# Altium schematic sheet Flash.SchDoc
size A4; SheetNumber: 8; SheetTotal: 10
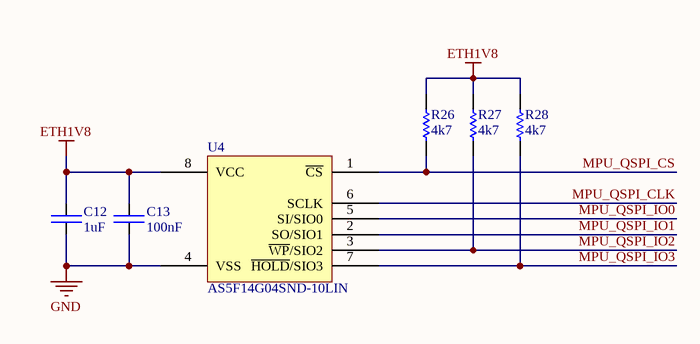
[diagram p0: Flash.SchDoc]

## Parts
C12  1uF  [CAP-0805]
C13  100nF  [CAP-0603]
R26  4k7  [RES-0603]
R27  4k7  [RES-0603]
R28  4k7  [RES-0603]
U4  AS5F14G04SND-10LIN  [AS5F34G04SNDA-08LIN]

## Nets
ETH1V8: C12.2 C13.2 R26.2 R27.2 R28.2 U4.8(VCC)
GND: C12.1 C13.1 U4.4(VSS)
MPU_QSPI_CLK: U4.6(SCLK)
MPU_QSPI_CS: R26.1 U4.1(~{CS})
MPU_QSPI_IO0: U4.5(SI/SIO0)
MPU_QSPI_IO1: U4.2(SO/SIO1)
MPU_QSPI_IO2: R27.1 U4.3(~{WP}/SIO2)
MPU_QSPI_IO3: R28.1 U4.7(~{HOLD}/SIO3)

## Library data of the parts
C12 = CAP-0805: Capacitor chip unpolarized. 0805
C13 = CAP-0603: Capacitor chip unpolarized. 0603
R26-R28 = RES-0603: Resistor chip. 0603
U4 = AS5F34G04SNDA-08LIN: FLASH SPI/QUAD 4GBIT